# EAGLE design CubeControl (EAGLE 7.2.0)
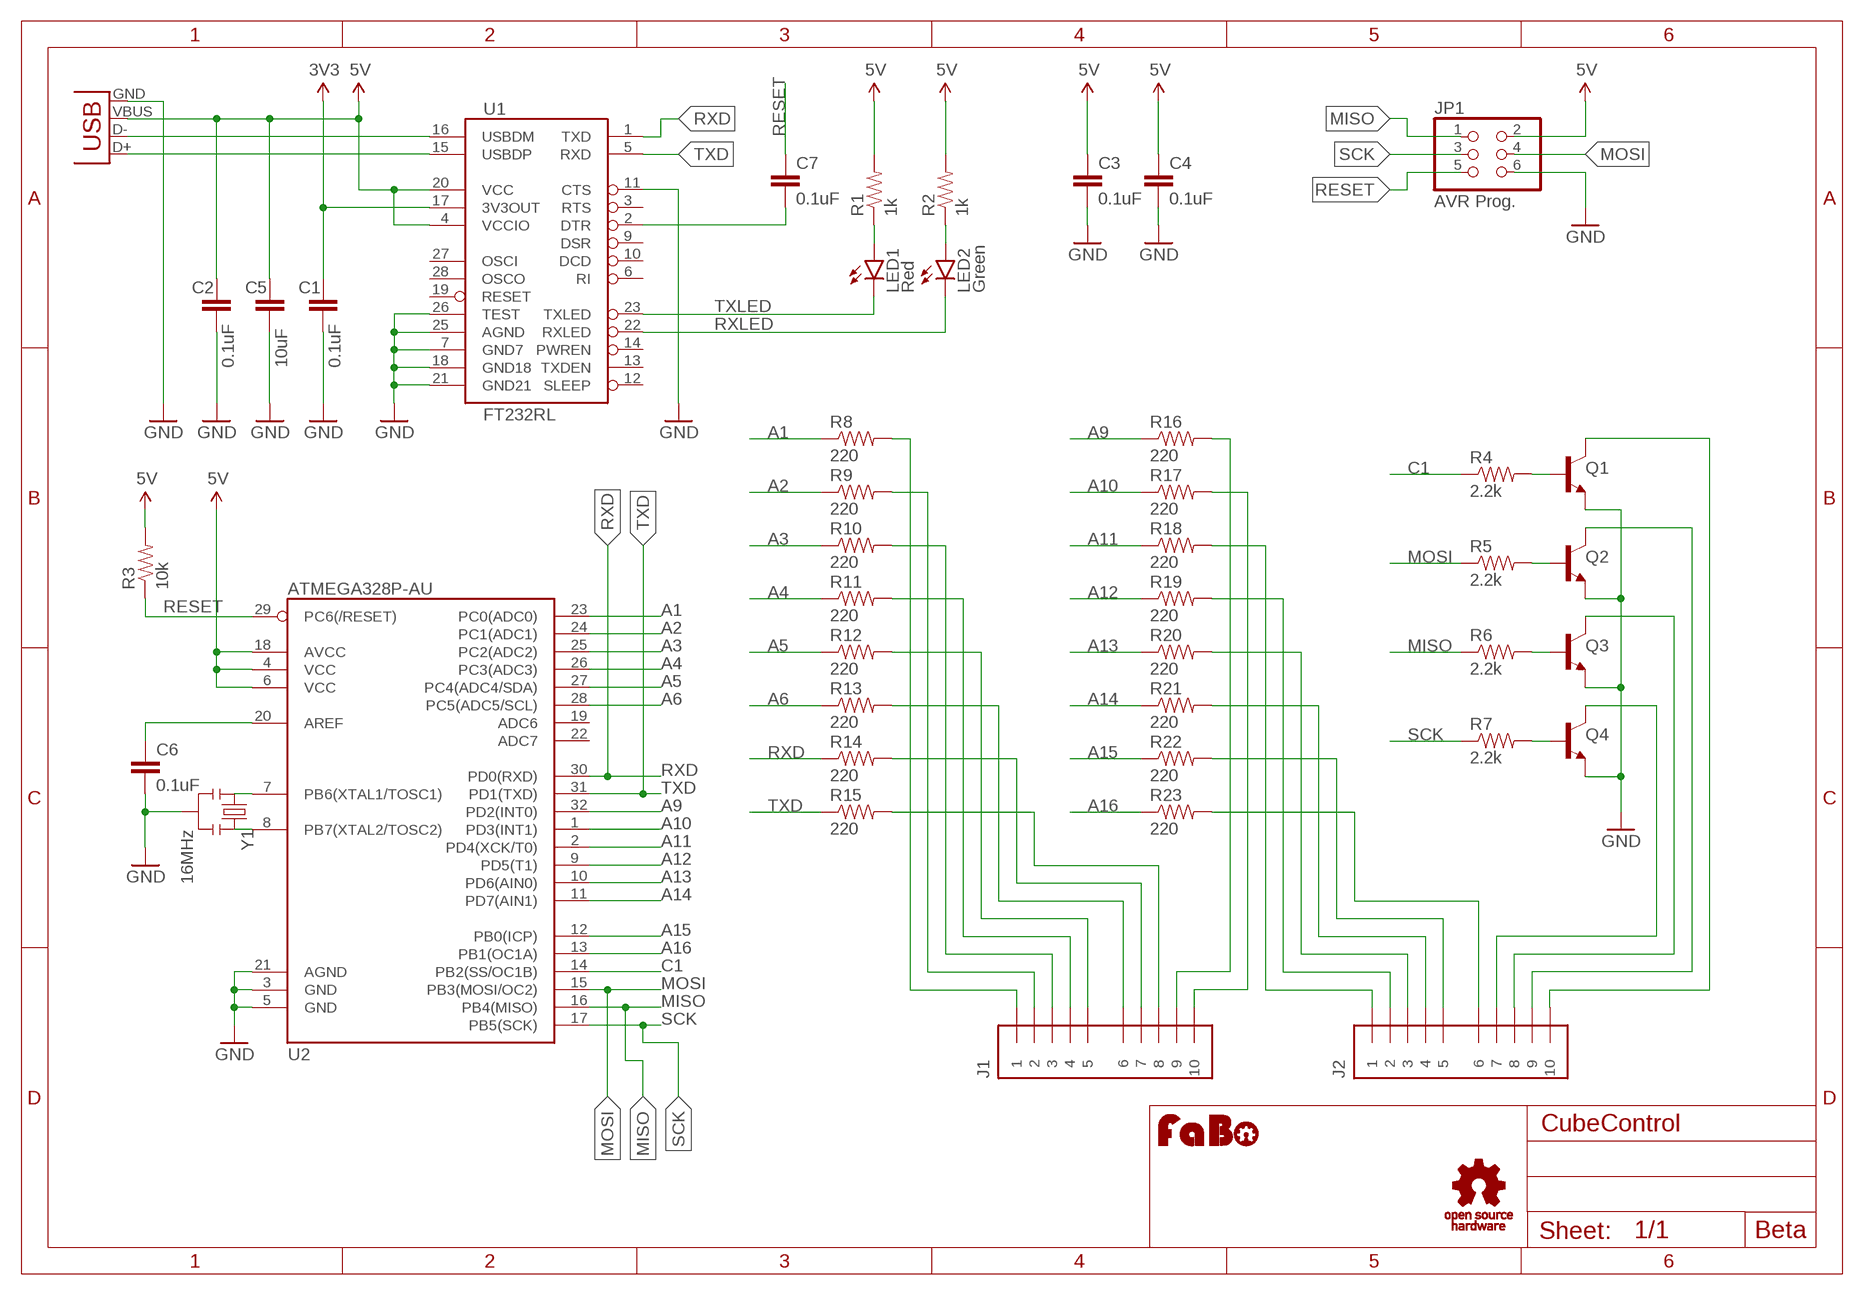
[diagram p0: schematic, sheet 1]

## Parts
C1  0.1uF  CAPACITOR0603  [EIA0603-CAP]
C2  0.1uF  CAPACITOR0603  [EIA0603-CAP]
C3  0.1uF  CAPACITOR0603  [EIA0603-CAP]
C4  0.1uF  CAPACITOR0603  [EIA0603-CAP]
C5  10uF  CAPACITOR1206  [EIA1206@1]
C6  0.1uF  CAPACITOR0603  [EIA0603-CAP]
C7  0.1uF  CAPACITOR0603  [EIA0603-CAP]
J1  PINHEAD-1X10  [1X10-SNEAKY]
J2  PINHEAD-1X10  [1X10-SNEAKY]
JP1  AVR Prog.  PINHD-2X3  [2X03]
LED1  Red  LED-EIA0603  [EIA0603-LED]
LED2  Green  LED-EIA0603  [EIA0603-LED]
Q1  NPN-2SC3325  [SOT23-3]
Q2  NPN-2SC3325  [SOT23-3]
Q3  NPN-2SC3325  [SOT23-3]
Q4  NPN-2SC3325  [SOT23-3]
R1  1k  RESISTOR0603  [EIA0603-RES]
R2  1k  RESISTOR0603  [EIA0603-RES]
R3  10k  RESISTOR0603  [EIA0603-RES]
R4  2.2k  RES-EIA0603  [EIA0603]
R5  2.2k  RES-EIA0603  [EIA0603]
R6  2.2k  RES-EIA0603  [EIA0603]
R7  2.2k  RES-EIA0603  [EIA0603]
R8  220  RES-EIA0603  [EIA0603]
R9  220  RES-EIA0603  [EIA0603]
R10  220  RES-EIA0603  [EIA0603]
R11  220  RES-EIA0603  [EIA0603]
R12  220  RES-EIA0603  [EIA0603]
R13  220  RES-EIA0603  [EIA0603]
R14  220  RES-EIA0603  [EIA0603]
R15  220  RES-EIA0603  [EIA0603]
R16  220  RES-EIA0603  [EIA0603]
R17  220  RES-EIA0603  [EIA0603]
R18  220  RES-EIA0603  [EIA0603]
R19  220  RES-EIA0603  [EIA0603]
R20  220  RES-EIA0603  [EIA0603]
R21  220  RES-EIA0603  [EIA0603]
R22  220  RES-EIA0603  [EIA0603]
R23  220  RES-EIA0603  [EIA0603]
U1  FT232RL  [SSOP28]
U2  ATMEGA328P-AU  [TQFP-32-08]
U$2  LOGO_OSHW_T-S  [LOGO_OSHW_T_S]
U$3  LOGO_FABO-M  [LOGO_FABO_M]
USB1  USB-B-MICRO_SMD  [USB_B_MICRO]
Y1  16MHz  RESONATOR  [RESONATOR_SMD]

## Nets
3V3: C1.1 U1.17(3V3OUT)
5V: C2.1 C3.1 C4.1 C5.1 JP1.2 R1.2 R2.2 R3.2 U1.4(VCCIO) U1.20(VCC) U2.4(VCC) U2.6(VCC) U2.18(AVCC) USB1.VBUS
A1: R8.1 U2.23(PC0(ADC0))
A2: R9.1 U2.24(PC1(ADC1))
A3: R10.1 U2.25(PC2(ADC2))
A4: R11.1 U2.26(PC3(ADC3))
A5: R12.1 U2.27(PC4(ADC4/SDA))
A6: R13.1 U2.28(PC5(ADC5/SCL))
A9: R16.1 U2.32(PD2(INT0))
A10: R17.1 U2.1(PD3(INT1))
A11: R18.1 U2.2(PD4(XCK/T0))
A12: R19.1 U2.9(PD5(T1))
A13: R20.1 U2.10(PD6(AIN0))
A14: R21.1 U2.11(PD7(AIN1))
A15: R22.1 U2.12(PB0(ICP))
A16: R23.1 U2.13(PB1(OC1A))
C1: R4.1 U2.14(PB2(SS/OC1B))
GND: C1.2 C2.2 C3.2 C4.2 C5.2 C6.2 JP1.6 Q1.2(E) Q2.2(E) Q3.2(E) Q4.2(E) U1.7(GND7) U1.11(CTS) U1.18(GND18) U1.21(GND21) U1.25(AGND) U1.26(TEST) U2.3(GND) U2.5(GND) U2.21(AGND) USB1.GND Y1.2
MISO: JP1.1 R6.1 U2.16(PB4(MISO))
MOSI: JP1.4 R5.1 U2.15(PB3(MOSI/OC2))
N$1: LED1.A R1.1
N$2: LED2.A R2.1
N$3: J1.1 R8.2
N$4: J1.2 R9.2
N$5: U2.7(PB6(XTAL1/TOSC1)) Y1.1
N$6: U2.8(PB7(XTAL2/TOSC2)) Y1.3
N$7: C6.1 U2.20(AREF)
N$8: J1.3 R10.2
N$9: J1.4 R11.2
N$10: J1.5 R12.2
N$11: J1.6 R13.2
N$12: J1.7 R14.2
N$13: J1.8 R15.2
N$14: J1.9 R16.2
N$15: J1.10 R17.2
N$16: J2.1 R18.2
N$17: J2.2 R19.2
N$18: J2.3 R20.2
N$19: J2.4 R21.2
N$20: J2.5 R22.2
N$21: J2.6 R23.2
N$22: C7.2 U1.2(DTR)
N$23: J2.10 Q1.3(C)
N$24: J2.9 Q2.3(C)
N$25: J2.8 Q3.3(C)
N$26: J2.7 Q4.3(C)
N$36: Q4.1(B) R7.2
N$37: Q3.1(B) R6.2
N$38: Q2.1(B) R5.2
N$39: Q1.1(B) R4.2
RESET: C7.1 JP1.5 R3.1 U2.29(PC6(/RESET))
RXD: R14.1 U1.1(TXD) U2.30(PD0(RXD))
RXLED: LED2.C U1.22(RXLED)
SCK: JP1.3 R7.1 U2.17(PB5(SCK))
TXD: R15.1 U1.5(RXD) U2.31(PD1(TXD))
TXLED: LED1.C U1.23(TXLED)
USB_D+: U1.15(USBDP) USB1.D+
USB_D-: U1.16(USBDM) USB1.D-
Unconnected: U1.3(RTS) U1.6(RI) U1.9(DSR) U1.10(DCD) U1.12(SLEEP) U1.13(TXDEN) U1.14(PWREN) U1.19(RESET) U1.27(OSCI) U1.28(OSCO) U2.19(ADC6) U2.22(ADC7)

## Notes on the sheet
- Beta

## Library data of the parts
C1-C7 = Gclue:CAPACITOR: Capacitor
J1 J2 = Gclue:PINHEAD-1X10
JP1 = pinhead:PINHD-2X3: PIN HEADER
LED1 LED2 = Gclue:LED: LED
Q1-Q4 = Gclue:NPN
R1-R3 = Gclue:RESISTOR
R4-R23 = Gclue:RES
U1 = Gclue:FT232RL: FT232RL FTDI FT232RL USB to serial UART interface SSOP28
U2 = Gclue:ATMEGA328P-AU: ATmega328p-AU
U$2 = Gclue:LOGO_OSHW_T
U$3 = FaBo:LOGO_FABO
USB1 = Gclue:USB: USB Female
Y1 = Gclue:RESONATOR: RESONATOR CSTCE16M0V53

## Net classes
0 default: width 0.254 mm

## Board
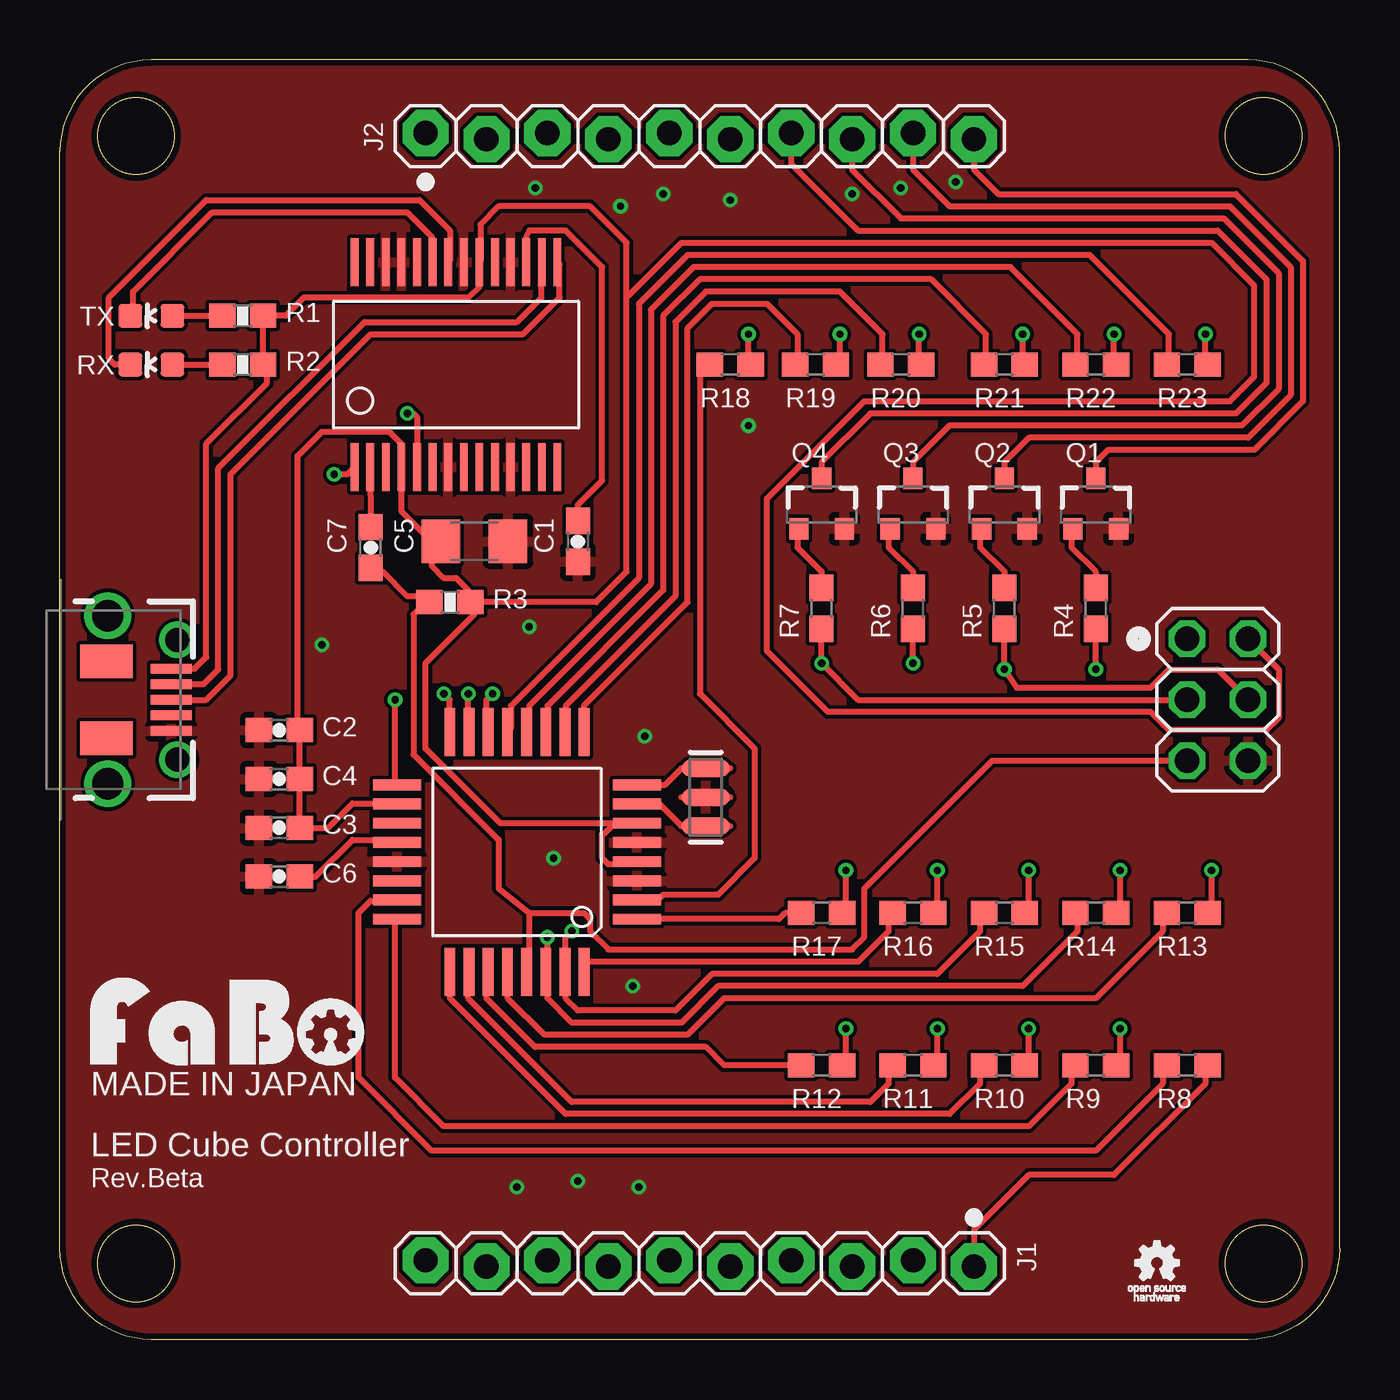
[diagram p1: board, top side]
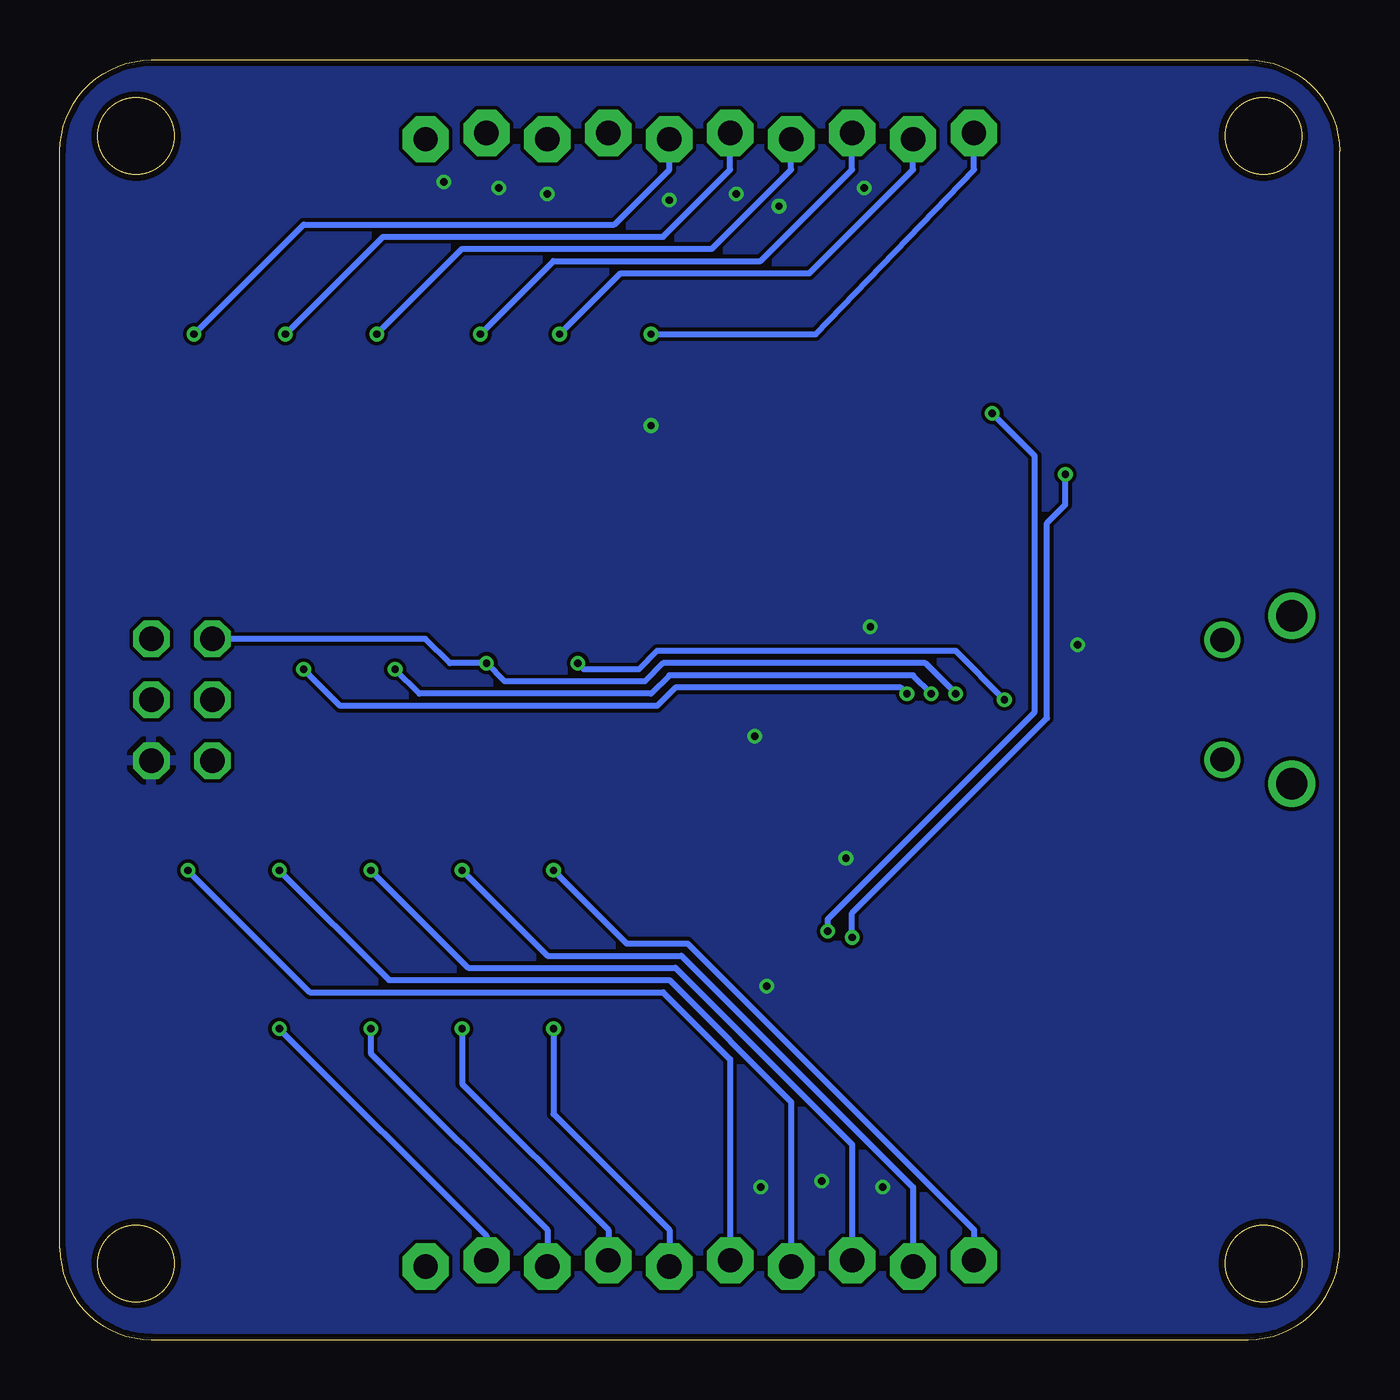
[diagram p2: board, bottom side, seen from below]

Size 53.34 x 53.34 mm. Coordinates in mm from the lower left corner, seen from the top.
Outline: 49.53,0 3.81,0 arc-90 0,3.81 0,49.53 arc-90 3.81,53.34 49.53,53.34 arc-90 53.34,49.53 53.34,3.81 arc-90 49.53,0
Outline: circle at 3.17,3.17 radius 1.6
Outline: circle at 3.17,50.16 radius 1.6
Outline: circle at 50.16,3.17 radius 1.6
Outline: circle at 50.16,50.16 radius 1.6
Copper layers (1*16): Top 0.035mm / dielectric 1.5mm / Bottom 0.035mm
Design rules "Elecrow_2-layer_eagle_rule": minimum track width 6mil, minimum drill 12mil, track to track 6mil, track to pad 6mil, pad to pad 6mil, via to via 6mil, smd to smd 0mil, copper to edge 10mil, drill to drill 10mil, minimum pad ring 10mil, minimum via ring 6mil, stop-mask expansion 2mil, vias tented up to drill 100mil, thermal gap 10mil

### Footprints (pad centres in the part's own frame; a part is rotated, then mirrored left to right if it is on the bottom)
EIA0603-CAP = smd 1.1 x 1: 1 -0.85,0; 2 0.85,0
EIA1206@1 = smd 1.6 x 1.8: 1 -1.4,0; 2 1.4,0
1X10-SNEAKY = drill 1.016 pad 1.93 octagon: 1 -11.43,0.127; 2 -8.89,-0.127; 3 -6.35,0.127; 4 -3.81,-0.127; 5 -1.27,0.127; 6 1.27,-0.127; 7 3.81,0.127; 8 6.35,-0.127; 9 8.89,0.127; 10 11.43,-0.127
2X03 = drill 1.016 octagon: 1 -2.54,-1.27; 2 -2.54,1.27; 3 0,-1.27; 4 0,1.27; 5 2.54,-1.27; 6 2.54,1.27
EIA0603-LED = smd 1 x 1: A 0,-0.877; C 0,0.877
SOT23-3 = smd 0.8 x 0.9: 1 -0.95,-1; 2 0.95,-1; 3 0,1.1
EIA0603-RES = smd 1.1 x 1: 1 -0.85,0; 2 0.85,0
EIA0603 = smd 1.1 x 1: 1 -0.85,0; 2 0.85,0
SSOP28 = smd 0.325 x 2: 1 -4.225,-4.275; 2 -3.575,-4.275; 3 -2.925,-4.275; 4 -2.275,-4.275; 5 -1.625,-4.275; 6 -0.975,-4.275; 7 -0.325,-4.275; 8 0.325,-4.275; 9 0.975,-4.275; 10 1.625,-4.275; 11 2.275,-4.275; 12 2.925,-4.275; 13 3.575,-4.275; 14 4.225,-4.275; 15 4.225,4.275; 16 3.575,4.275; 17 2.925,4.275; 18 2.275,4.275; 19 1.625,4.275; 20 0.975,4.275; 21 0.325,4.275; 22 -0.325,4.275; 23 -0.975,4.275; 24 -1.625,4.275; 25 -2.275,4.275; 26 -2.925,4.275; 27 -3.575,4.275; 28 -4.225,4.275
TQFP-32-08 = smd 2 x 0.45: 1 -5,2.8; 2 -5,2; 3 -5,1.2; 4 -5,0.4; 5 -5,-0.4; 6 -5,-1.2; 7 -5,-2; 8 -5,-2.8; 17 5,-2.8; 18 5,-2; 19 5,-1.2; 20 5,-0.4; 21 5,0.4; 22 5,1.2; 23 5,2; 24 5,2.8 | smd 0.45 x 2: 9 -2.8,-5; 10 -2,-5; 11 -1.2,-5; 12 -0.4,-5; 13 0.4,-5; 14 1.2,-5; 15 2,-5; 16 2.8,-5; 25 2.8,5; 26 2,5; 27 1.2,5; 28 0.4,5; 29 -0.4,5; 30 -1.2,5; 31 -2,5; 32 -2.8,5
USB_B_MICRO = smd 1.7 x 0.4: D+ 2.1,0; D- 2.1,0.65; GND 2.1,-1.3; ID 2.1,-0.65; VBUS 2.1,1.3 | drill 1 pad 1.4: P$1 2.35,2.5; P$2 2.35,-2.5 | drill 1.3 pad 1.7: P$3 -0.55,3.5; P$4 -0.55,-3.5 | smd 2.2 x 1.4: P$6 -0.6,1.6; P$7 -0.6,-1.6
RESONATOR_SMD = smd 0.7 x 2: 1 -1.2,0; 2 0,0; 3 1.2,0

### Placement (x,y rotation side)
C1  21.59,33.27 270 top
C2  9.14,25.4 180 top
C3  9.14,21.34 180 top
C4  9.14,23.37 180 top
C5  17.27,33.27 0 top
C6  9.14,19.3 180 top
C7  12.95,33.02 90 top
J1  26.67,3.17 180 top
J2  26.67,50.16 0 top
JP1  48.26,26.67 270 top
LED1  3.81,42.67 90 top
LED2  3.81,40.64 90 top
Q1  43.18,34.8 0 top
Q2  39.37,34.8 0 top
Q3  35.56,34.8 0 top
Q4  31.75,34.8 0 top
R1  7.62,42.67 0 top
R2  7.62,40.64 0 top
R3  16.26,30.73 0 top
R4  43.18,30.48 90 top
R5  39.37,30.48 90 top
R6  35.56,30.48 90 top
R7  31.75,30.48 90 top
R8  46.99,11.43 0 top
R9  43.18,11.43 0 top
R10  39.37,11.43 0 top
R11  35.56,11.43 0 top
R12  31.75,11.43 0 top
R13  46.99,17.78 0 top
R14  43.18,17.78 0 top
R15  39.37,17.78 0 top
R16  35.56,17.78 0 top
R17  31.75,17.78 0 top
R18  27.94,40.64 0 top
R19  31.5,40.64 0 top
R20  35.05,40.64 0 top
R21  39.37,40.64 0 top
R22  43.18,40.64 0 top
R23  46.99,40.64 0 top
U1  16.51,40.64 0 top
U2  19.05,20.32 180 top
U$2  45.72,3.17 0 top
U$3  6.99,11.43 0 top
USB1  2.54,26.67 0 top
Y1  26.92,22.61 90 top

### Tracks (layer width: path | path; a pad name or v marks a point on that pad's centre or on a via)
3V3
  Top 0.254: C1.1 21.59,34.8 22.61,35.81 22.61,44.7 21.08,46.23 19.56,46.23 19.43,45.97 U1.17
5V
  Top 0.254: USB1.VBUS 5.62,27.97 6.1,28.45 6.1,37.34 8.64,39.88 8.64,40.47 R2.2 R1.2 9.4,42.67 10.16,43.43 17.02,43.43 17.48,43.9 U1.20 17.53,44.96 17.53,46.48 18.29,47.24 22.1,47.24 23.62,45.72 23.62,43.43 | 14.22,36.35 14.22,37.34 13.72,37.85 10.92,37.85 9.91,36.83 9.91,25.65 C2.1 C4.1 C3.1 11.18,21.34 12.19,22.35 14.02,22.35 U2.18 | 14.22,36.35 U1.4 | 17.27,30.73 R3.2 17.02,30.99 17.02,31.24 16.51,31.75 16,31.75 15.49,32.26 15.49,33.27 | 17.27,30.73 22.35,30.73 23.62,32 23.62,43.43 | C5.1 15.49,33.27 | 14.22,36.35 14.22,34.54 15.49,33.27 | U2.6 23.11,21.52 | 23.11,21.52 18.36,21.52 15.24,24.64 15.24,28.19 17.27,30.23 17.27,30.73 | U2.4 23.73,19.92 23.62,19.81 22.86,19.81 22.61,20.07 22.61,21.08 22.68,21.08 23.11,21.52 | JP1.2 50.8,27.94 50.8,25.91 50.29,25.4 46.23,25.4 45.47,26.16 32,26.16 29.46,28.7 29.46,35.05 33.53,39.12 48.77,39.12 49.78,40.13 49.78,43.94 48.01,45.72 25.91,45.72 23.62,43.43
A1
  Top 0.254: R8.1 45.97,11.18 45.97,10.67 43.18,7.87 15.49,7.87 12.45,10.92 12.45,17.78 12.95,18.29 14.02,18.29 U2.23
A2
  Top 0.254: R9.1 42.16,11.18 42.16,10.67 40.39,8.89 16,8.89 13.96,10.93 13.97,17.02 13.97,17.44 U2.24
A3
  Top 0.254: R10.1 38.35,11.43 38.35,10.67 37.08,9.4 21.08,9.4 16.26,14.22 U2.25
A4
  Top 0.254: R11.1 34.54,11.18 34.54,10.67 33.78,9.91 21.34,9.91 17.02,14.22 17.02,15.24 U2.26
A5
  Top 0.254: R12.1 27.69,11.43 26.92,12.19 19.81,12.19 17.78,14.22 17.78,15.24 U2.27
A6
  Top 0.254: R13.1 45.97,17.53 45.97,17.02 43.18,14.22 27.69,14.22 26.16,12.7 20.19,12.7 18.67,14.22 18.67,14.99 U2.28
A9
  Top 0.254: R16.1 34.54,17.53 34.54,17.02 33.27,15.75 21.84,15.75 U2.32
A10
  Top 0.254: R17.1 30.23,17.78 29.97,17.53 24.89,17.53 U2.1
A11
  Top 0.254: R18.1 26.67,40.39 26.67,26.92 28.96,24.64 28.96,20.07 27.43,18.54 25.15,18.54 24.89,18.29 24.08,18.29 U2.2
A12
  Top 0.254: U2.9 21.85,26.42 26.16,30.73 26.16,42.16 27.18,43.18 29.46,43.18 30.73,41.91 30.73,40.89 R19.1
A13
  Top 0.254: R20.1 34.29,40.89 34.29,41.91 32.51,43.69 26.92,43.69 25.65,42.42 25.65,30.99 21.08,26.42 21.08,25.35 U2.10
A14
  Top 0.254: R21.1 38.61,40.89 38.61,41.91 36.32,44.2 26.67,44.2 25.15,42.67 25.15,31.24 20.32,26.42 20.32,25.39 U2.11
A15
  Top 0.254: R22.1 42.42,40.89 42.42,41.91 39.62,44.7 26.42,44.7 24.64,42.93 24.64,31.5 19.56,26.42 19.56,25.43 U2.12
A16
  Top 0.254: R23.1 46.23,40.89 46.23,41.91 42.93,45.21 26.16,45.21 24.13,43.18 24.13,31.75 18.8,26.42 18.8,25.47 U2.13
C1  (via drill 0.3)
  Top 0.254: U2.14 17.78,25.4 17.78,26.67 v18.03,26.92 | v43.18,27.94 R4.1
  Bottom 0.254: v18.03,26.92 18.29,27.18 27.69,27.18 28.45,26.42 41.66,26.42 v43.18,27.94
GND  (via drill 0.3)
  other vias: 28.7,38.1 19.56,29.72 24.38,25.15 10.92,28.96 20.57,20.07 23.88,14.73 24.13,6.35 21.59,6.6 19.05,6.35 37.34,48.26 35.05,48.01 33.02,47.75 27.94,47.5 25.15,47.75 23.37,47.24 19.81,48.01
  pour Bottom: -1.27,-1.27 54.61,-1.27 54.61,54.61 -1.27,54.61
  pour Top: -1.27,-1.27 54.61,-1.27 54.61,54.61 -1.27,54.61
MISO  (via drill 0.3)
  Top 0.254: U2.16 16.25,26.66 16.26,26.67 v16,26.92 | v35.56,28.19 R6.1
  Bottom 0.254: v16,26.92 17.27,28.19 28.19,28.19 28.96,27.43 34.8,27.43 v35.56,28.19 37.08,28.19 38.1,29.21 JP1.1
MOSI  (via drill 0.3)
  Top 0.254: U2.15 17.05,25.62 17.02,25.65 v17.02,26.92 | R5.1 v39.37,27.94 39.88,27.18 45.47,27.18 46.23,27.94 48.26,27.94 JP1.4
  Bottom 0.254: v17.02,26.92 17.78,27.69 27.94,27.69 28.7,26.92 38.35,26.92 v39.37,27.94
N$1
  Top 0.254: LED1.A R1.1
N$2
  Top 0.254: LED2.A R2.1
N$3
  Top 0.254: R8.2 47.84,11.26 47.75,11.18 47.75,10.67 43.94,6.86 40.39,6.86 38.1,4.57 J1.1
N$4  (via drill 0.3)
  Top 0.254: R9.2 44.03,11.52 44.2,11.68 v44.2,12.95
  Bottom 0.254: v44.2,12.95 35.56,4.32 J1.2
N$5
  Top 0.254: U2.7 24.99,22.32 25.91,21.41
N$6
  Top 0.254: U2.8 25.22,23.12 25.91,23.81
N$7
  Top 0.254: C6.1 10.67,19.3 12.19,20.83 13.46,20.83 U2.20
N$8  (via drill 0.3)
  Top 0.254: R10.2 40.22,11.52 40.39,11.68 v40.39,12.95
  Bottom 0.254: v40.39,12.95 40.39,11.94 33.02,4.57 J1.3
N$9  (via drill 0.3)
  Top 0.254: R11.2 36.41,11.52 36.58,11.68 v36.58,12.95
  Bottom 0.254: v36.58,12.95 36.58,10.67 30.48,4.57 J1.4
N$10  (via drill 0.3)
  Top 0.254: R12.2 32.6,11.52 32.77,11.68 v32.77,12.95
  Bottom 0.254: v32.77,12.95 32.77,9.4 27.94,4.57 J1.5
N$11  (via drill 0.3)
  Top 0.254: R13.2 48.01,18.03 v48.01,19.56
  Bottom 0.254: v48.01,19.56 42.93,14.48 28.19,14.48 25.4,11.68 J1.6
N$12  (via drill 0.3)
  Top 0.254: R14.2 44.03,17.95 44.2,18.03 v44.2,19.56
  Bottom 0.254: v44.2,19.56 39.62,14.99 27.94,14.99 22.86,9.91 J1.7
N$13  (via drill 0.3)
  Top 0.254: R15.2 40.22,17.87 40.39,18.03 v40.39,19.56
  Bottom 0.254: v40.39,19.56 36.32,15.49 27.69,15.49 20.32,8.13 J1.8
N$14  (via drill 0.3)
  Top 0.254: R16.2 36.41,17.87 36.58,18.03 v36.58,19.56
  Bottom 0.254: v36.58,19.56 33.02,16 27.43,16 17.78,6.35 J1.9
N$15  (via drill 0.3)
  Top 0.254: R17.2 32.6,17.87 32.77,18.03 v32.77,19.56
  Bottom 0.254: v32.77,19.56 29.72,16.51 27.18,16.51 15.24,4.57 J1.10
N$16  (via drill 0.3)
  Top 0.254: R18.2 28.7,41.15 v28.7,41.91
  Bottom 0.254: v28.7,41.91 21.84,41.91 15.24,48.77 J2.1
N$17  (via drill 0.3)
  Top 0.254: R19.2 32.51,41.15 v32.51,41.91
  Bottom 0.254: v32.51,41.91 29.97,44.45 22.1,44.45 17.78,48.77 J2.2
N$18  (via drill 0.3)
  Top 0.254: R20.2 35.81,40.89 v35.81,41.91
  Bottom 0.254: v35.81,41.91 32.77,44.96 24.13,44.96 20.32,48.77 J2.3
N$19  (via drill 0.3)
  Top 0.254: R21.2 40.13,40.89 v40.13,41.91
  Bottom 0.254: v40.13,41.91 36.58,45.47 26.16,45.47 22.86,48.77 J2.4
N$20  (via drill 0.3)
  Top 0.254: R22.2 43.94,41.15 v43.94,41.91
  Bottom 0.254: v43.94,41.91 39.88,45.97 28.19,45.97 25.4,48.77 J2.5
N$21  (via drill 0.3)
  Top 0.254: R23.2 47.75,41.15 v47.75,41.91
  Bottom 0.254: v47.75,41.91 43.18,46.48 30.23,46.48 27.94,48.77 J2.6
N$22
  Top 0.254: U1.2 12.94,35.58 12.95,34.8 C7.2
N$23
  Top 0.254: J2.10 38.1,48.77 39.12,47.75 49.02,47.75 51.82,44.96 51.82,39.12 49.78,37.08 43.69,37.08 43.18,36.58 Q1.3
N$24
  Top 0.254: J2.9 35.56,48.77 37.08,47.24 48.77,47.24 51.31,44.7 51.31,39.37 49.53,37.59 40.39,37.59 39.37,36.58 Q2.3
N$25
  Top 0.254: J2.8 33.02,48.77 35.05,46.74 48.51,46.74 50.8,44.45 50.8,39.62 49.28,38.1 37.08,38.1 35.56,36.58 Q3.3
N$26
  Top 0.254: J2.7 30.48,49.02 33.27,46.23 48.26,46.23 50.29,44.2 50.29,39.88 49.02,38.61 33.78,38.61 31.75,36.58 Q4.3
N$36
  Top 0.254: Q4.1 30.8,33.59 30.73,33.53 30.73,33.02 31.75,32 R7.2
N$37
  Top 0.254: Q3.1 34.56,33.8 34.54,33.78 34.54,33.02 35.56,32 R6.2
N$38
  Top 0.254: Q2.1 38.35,33.78 38.35,33.02 39.37,32 R5.2
N$39
  Top 0.254: Q1.1 42.16,33.53 42.16,33.02 43.18,32 R4.2
RESET
  Top 0.254: 15.24,30.73 R3.1 | C7.1 13.21,32 13.46,32 14.48,30.99 14.99,30.99 15.24,30.73 | 15.24,30.73 14.73,30.23 14.73,24.38 18.29,20.83 18.29,18.8 19.56,17.78 | 19.56,17.78 19.56,15.43 U2.29 | 19.56,17.78 21.84,17.78 22.1,17.53 22.1,17.02 22.86,16.26 33.02,16.26 33.53,16.76 33.53,18.8 38.86,24.13 JP1.5
RXD  (via drill 0.3)
  Top 0.254: R14.1 42.42,17.53 42.42,17.02 40.13,14.73 27.43,14.73 25.91,13.21 21.34,13.21 20.32,14.22 20.32,14.99 U2.30 20.25,16.19 20.32,16.26 v20.32,16.76 | v11.43,36.07 11.99,36.07 U1.1
  Bottom 0.254: v20.32,16.76 20.32,17.78 12.19,25.91 12.19,34.04 11.43,34.8 v11.43,36.07
RXLED
  Top 0.254: LED2.C 2.29,40.64 2.03,40.89 2.03,43.43 6.1,47.5 14.99,47.5 16.26,46.23 16.26,44.99 U1.22
SCK  (via drill 0.3)
  Top 0.254: U2.17 13.98,23.12 13.97,23.11 v13.97,26.67 | R7.1 v31.75,28.19 33.27,26.67 JP1.3
  Bottom 0.254: v13.97,26.67 16,28.7 28.45,28.7 29.21,27.94 31.5,27.94 v31.75,28.19
TXD  (via drill 0.3)
  Top 0.254: R15.1 38.35,17.53 38.35,17.02 36.58,15.24 27.18,15.24 25.65,13.72 21.59,13.72 21.08,14.22 21.08,14.73 U2.31 21.05,16.22 21.08,16.26 21.08,16.76 v21.34,17.02 | v14.48,38.61 14.73,38.61 14.88,38.45 U1.5
  Bottom 0.254: v21.34,17.02 21.34,17.53 12.7,26.16 12.7,36.83 v14.48,38.61
TXLED
  Top 0.254: LED1.C 3.05,42.93 3.05,43.69 6.35,46.99 14.48,46.99 15.49,45.97 15.49,44.96 U1.23
USB_D+
  Top 0.254: USB1.D+ 6.1,26.67 7.11,27.69 7.11,36.07 12.95,41.91 19.3,41.91 20.83,43.43 20.83,44.82 U1.15
USB_D-
  Top 0.254: USB1.D- 5.98,27.32 6.6,27.94 6.6,36.32 12.7,42.42 19.05,42.42 20.07,43.43 20.07,44.9 U1.16

### Text on the board
tPlace: TX | RX | MADE IN JAPAN | LED Cube Controller | Rev.Beta